# EAGLE design atmega_WS2812_RGB (EAGLE 6.3)
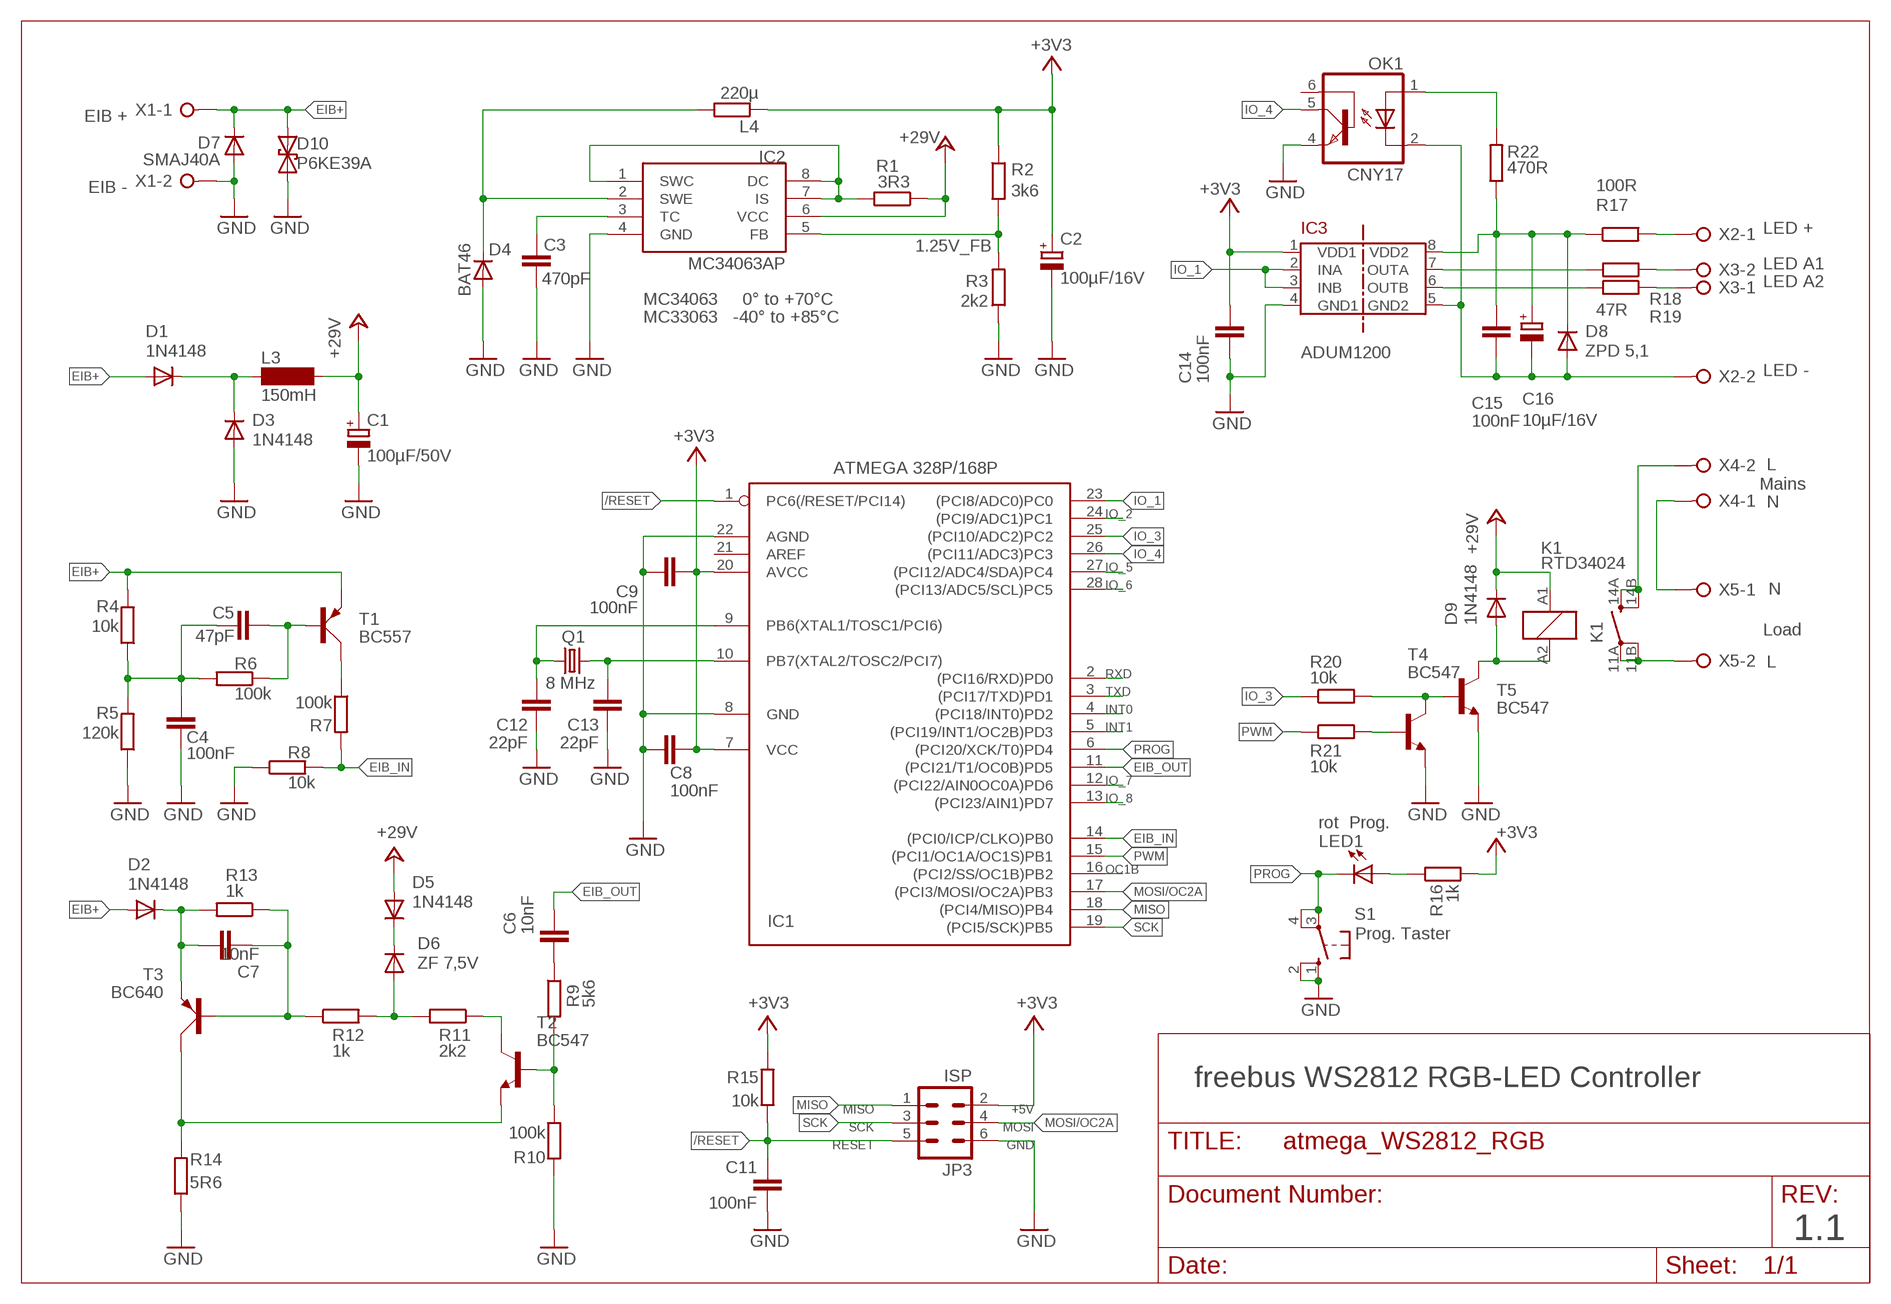
[diagram p0: schematic, sheet 1]

## Parts
C1  100µF/50V  CPOL-EUE3.5-8  [E3,5-8]
C2  100µF/16V  CPOL-EUE3.5-8  [E3,5-8]
C3  470pF  C-EU025-024X044  [C025-024X044]
C4  100nF  C-EU025-024X044  [C025-024X044]
C5  47pF  C-EU025-024X044  [C025-024X044]
C6  10nF  C-EU025-024X044  [C025-024X044]
C7  10nF  C-EU025-024X044  [C025-024X044]
C8  100nF  C-EU025-024X044  [C025-024X044]
C9  100nF  C-EU025-024X044  [C025-024X044]
C11  100nF  C-EU025-024X044  [C025-024X044]
C12  22pF  C-EU025-024X044  [C025-024X044]
C13  22pF  C-EU025-024X044  [C025-024X044]
C14  100nF  C-EU025-024X044  [C025-024X044]
C15  100nF  C-EU025-024X044  [C025-024X044]
C16  10µF/16V  CPOL-EUE2-5  [E2-5]
D1  1N4148  1N4148DO34-7R  [DO34-7R]
D2  1N4148  1N4148DO34-7R  [DO34-7R]
D3  1N4148  1N4148DO34-7R  [DO34-7R]
D4  BAT46  1N4148DO34-7R  [DO34-7R]
D5  1N4148  1N4148DO34-7R  [DO34-7R]
D6  ZF 7,5V  1N4148DO34-7R  [DO34-7R]
D7  SMAJ40A  D-SMB  [SMB]
D8  ZPD 5,1  1N4148DO34-7R  [DO34-7R]
D9  1N4148  1N4148DO34-7R  [DO34-7R]
D10  P6KE39A  P6KEXXCDO41-7  [DO41-7]
IC1  ATMEGA 328P/168P  ATMEGA168-20P  [DIL28-3]
IC2  MC34063AP  [DIL08]
IC3  ADUM1200  [SO8]
JP3  ISP  ISP_6POLML6  [ML6]
K1  RTD34024  [RT-N/O16A5]
L3  150mH  BS11  [BS11]
L4  220µ  R-EU_0309/12  [0309/12]
LED1  rot Prog.  LED3MM  [LED3MM]
OK1  CNY17  [DIL06]
Q1  8 MHz  CRYSTALHC49U-V  [HC49U-V]
R1  3R3  R-EU_0207/7  [0207/7]
R2  3k6  R-EU_0207/7  [0207/7]
R3  2k2  R-EU_0207/7  [0207/7]
R4  10k  R-EU_0207/7  [0207/7]
R5  120k  R-EU_0207/7  [0207/7]
R6  100k  R-EU_0207/7  [0207/7]
R7  100k  R-EU_0207/7  [0207/7]
R8  10k  R-EU_0207/7  [0207/7]
R9  5k6  R-EU_0207/7  [0207/7]
R10  100k  R-EU_0207/7  [0207/7]
R11  2k2  R-EU_0207/7  [0207/7]
R12  1k  R-EU_0207/7  [0207/7]
R13  1k  R-EU_0207/7  [0207/7]
R14  5R6  R-EU_0207/7  [0207/7]
R15  10k  R-EU_0207/7  [0207/7]
R16  1k  R-EU_0207/7  [0207/7]
R17  100R  R-EU_0207/7  [0207/7]
R18  47R  R-EU_0207/7  [0207/7]
R19  47R  R-EU_0207/7  [0207/7]
R20  10k  R-EU_0207/7  [0207/7]
R21  10k  R-EU_0207/7  [0207/7]
R22  470R  R-EU_0207/7  [0207/7]
S1  Prog. Taster  10-XX  [B3F-10XX]
T1  BC557  [SOT54A]
T2  BC547  [TO92]
T3  BC640  [SOT54D]
T4  BC547  [TO92]
T5  BC547  [TO92]
X1  W237-02P  [W237-132]
X2  W237-02P  [W237-132]
X3  W237-02P  [W237-132]
X4  W237-02P  [W237-132]
X5  W237-02P  [W237-132]

## Nets
1.25V_FB: IC2.5(FB) R2.2 R3.2
+3V3: C2.+ C8.1 C9.1 C14.2 IC1.7(VCC) IC1.20(AVCC) IC3.1(VDD1) JP3.2 L4.1 R2.1 R15.2 R16.2
+24V: C1.+ D5.A D9.C IC2.6(VCC) K1.A1 L3.2 R1.1 ; supply symbol labelled +29V
/RESET: C11.2 IC1.1(PC6(/RESET/PCI14)) JP3.5 R15.1
EIB+: D1.A D2.A D7.1(C) D10.C R4.2 T1.E X1.1
EIB_IN: IC1.14((PCI0/ICP/CLKO)PB0) R7.2 R8.2
EIB_OUT: C6.2 IC1.11((PCI21/T1/OC0B)PD5)
GND: C1.- C2.- C3.1 C4.1 C8.2 C9.2 C11.1 C12.2 C13.2 C14.1 D3.A D4.A D7.2(A) D10.A IC1.8(GND) IC1.22(AGND) IC2.4(GND) IC3.4(GND1) JP3.6 OK1.4(EMI) R3.1 R5.1 R8.1 R10.2 R14.1 S1.1(S) S1.2(S1) T4.1(E) T5.1(E) X1.2
INT0: IC1.4((PCI18/INT0)PD2)
INT1: IC1.5((PCI19/INT1/OC2B)PD3)
IO_1: IC1.23((PCI8/ADC0)PC0) IC3.2(INA) IC3.3(INB)
IO_2: IC1.24((PCI9/ADC1)PC1)
IO_3: IC1.25((PCI10/ADC2)PC2) R20.1
IO_4: IC1.26((PCI11/ADC3)PC3) OK1.5(COL)
IO_5: IC1.27((PCI12/ADC4/SDA)PC4)
IO_6: IC1.28((PCI13/ADC5/SCL)PC5)
IO_7: IC1.12((PCI22/AIN0OC0A)PD6)
IO_8: IC1.13((PCI23/AIN1)PD7)
MISO: IC1.18((PCI4/MISO)PB4) JP3.1
MOSI/OC2A: IC1.17((PCI3/MOSI/OC2A)PB3) JP3.4
N$1: R18.1 X3.2
N$2: C15.2 C16.+ D8.C IC3.8(VDD2) R17.1 R22.1
N$3: IC3.7(OUTA) R18.2
N$4: IC3.6(OUTB) R19.2
N$5: X4.1 X5.1
N$6: R17.2 X2.1
N$7: R21.2 T4.2(B)
N$8: R19.1 X3.1
N$9: LED1.A R16.1
N$11: R20.2 T4.3(C) T5.2(B)
N$12: K1.11A(2:PA) K1.11B(2:PB) X5.2
N$13: C4.2 C5.1 R4.1 R5.2 R6.2
N$14: R7.1 T1.C
N$15: K1.14A(2:SA) K1.14B(2:SB) X4.2
N$17: IC2.1(SWC) IC2.7(IS) IC2.8(DC) R1.2
N$18: D1.C D3.C L3.1
N$19: C6.1 R9.1
N$20: R9.2 R10.1 T2.2(B)
N$21: C7.2 R12.1 R13.1 T3.B
N$22: OK1.1(A) R22.2
N$23: D5.C D6.C
N$26: D4.C IC2.2(SWE) L4.2
N$27: C3.2 IC2.3(TC)
N$31: D6.A R11.2 R12.2
N$33: C5.2 R6.1 T1.B
N$34: R11.1 T2.3(C)
N$35: R14.2 T2.1(E) T3.C
N$36: C7.1 D2.C R13.2 T3.E
N$38: C13.1 IC1.10(PB7(XTAL2/TOSC2/PCI7)) Q1.2
N$39: C12.1 IC1.9(PB6(XTAL1/TOSC1/PCI6)) Q1.1
OC1B: IC1.16((PCI2/SS/OC1B)PB2)
PROG: IC1.6((PCI20/XCK/T0)PD4) LED1.K(C) S1.3(P) S1.4(P1)
PWM: IC1.15((PCI1/OC1A/OC1S)PB1) R21.1
R4: D9.A K1.A2 T5.3(C)
RXD: IC1.2((PCI16/RXD)PD0)
SCK: IC1.19((PCI5/SCK)PB5) JP3.3
TXD: IC1.3((PCI17/TXD)PD1)
WS2812_GND: C15.1 C16.- D8.A IC3.5(GND2) OK1.2(C) X2.2
Unconnected: IC1.21(AREF) OK1.6(BAS)

## Notes on the sheet
- EIB +
- EIB -
- LED +
- LED A1
- LED A2
- MC34063     0° to +70°C
- MC33063   -40° to +85°C
- ADUM1200
- LED -
- L
- Mains
- N
- N
- Load
- L
- freebus WS2812 RGB-LED Controller
- 1.1

## Library data of the parts
C1 C2 C16 = rcl:CPOL-EU: POLARIZED CAPACITOR, European symbol
C3-C9 C11-C15 = rcl:C-EU: CAPACITOR, European symbol
D1-D6 D8 D9 = diode:1N4148: DIODE high speed (Philips)
D7 = semicon-smd-ipc:D-: DIODE unfilled
D10 = diode:P6KEXXC: DIODE transient-voltage suppressor
IC1 = avr:ATMEGA168*P: MICROCONTROLLER 16 kBytes FLASH 1 kBytes SRAM 512 Bytes EEPROM USART 8-channel 10 bit ADC
IC2 = mc34063:MC34063
IC3 = Bus-isolators:ADUM1200
JP3 = avr:ISP_6POL
K1 = relay:RTD3*: Power PCB Relay SCHRACK 1 pole 12 / 16 A, DC- or AC-coil Source: http://www.schrack.com/.. 5819.pdf; MF: TYCO ELECTRONICS; MPN: RTD34024F; OC_FARNELL: 9850961; OC_NEWARK: 34K0187
L3 = Uwe:BS: INDUCTOR nominal inductance, magnetically screened; OC_FARNELL: unknown; OC_NEWARK: unknown
L4 R1-R22 = rcl:R-EU_: RESISTOR, European symbol
LED1 = Uwe:LED: LED OSRAM: - CHIPLED LG R971, LG N971, LY N971, LG Q971, LY Q971, LO R971, LY R971 LH N974, LH R974 LS Q976, LO Q976, LY Q976 LO Q996 - Hyper CHIPLED LW Q18S LB Q993, LB Q99A, LB R99A - SideLED LS A670, LO A670, LY A670, LG A670, LP A670 LB A673, LV A673, LT A673, LW A673 LH A674 LY A675 LS A676, LA A676, LO A676, LY A676, LW A676 LS A679, LY A679, LG A679 - Hyper Micro SIDELED® LS Y876, LA Y876, LO Y876, LY Y876 LT Y87S - SmartLED LW L88C, LW L88S LB L89C, LB L89S, LG L890 LS L89K, LO L89K, LY L89K LS L896, LA L896, LO L896, LY L896 - TOPLED LS T670, LO T670, LY T670, LG T670, LP T670 LSG T670, LSP T670, LSY T670, LOP T670, LYG T670 LG T671, LOG T671, LSG T671 LB T673, LV T673, LT T673, LW T673 LH T674 LS T676, LA T676, LO T676, LY T676, LB T676, LH T676, LSB T676, LW T676 LB T67C, LV T67C, LT T67C, LS T67K, LO T67K, LY T67K, LW E67C LS E67B, LA E67B, LO E67B, LY E67B, LB E67C, LV E67C, LT E67C LW T67C LS T679, LY T679, LG T679 LS T770, LO T770, LY T770, LG T770, LP T770 LB T773, LV T773, LT T773, LW T773 LH T774 LS E675, LA E675, LY E675, LS T675 LS T776, LA T776, LO T776, LY T776, LB T776 LHGB T686 LT T68C, LB T68C - Hyper Mini TOPLED® LB M676 - Mini TOPLED Santana® LG M470 LS M47K, LO M47K, LY M47K Source: http://www.osram.convergy.de LUXEON: - LUMILED® LXK2-PW12-R00, LXK2-PW12-S00, LXK2-PW14-U00, LXK2-PW14-V00 LXK2-PM12-R00, LXK2-PM12-S00, LXK2-PM14-U00 LXK2-PE12-Q00, LXK2-PE12-R00, LXK2-PE12-S00, LXK2-PE14-T00, LXK2-PE14-U00 LXK2-PB12-K00, LXK2-PB12-L00, LXK2-PB12-M00, LXK2-PB14-N00, LXK2-PB14-P00, LXK2-PB14-Q00 LXK2-PR12-L00, LXK2-PR12-M00, LXK2-PR14-Q00, LXK2-PR14-R00 LXK2-PD12-Q00, LXK2-PD12-R00, LXK2-PD12-S00 LXK2-PH12-R00, LXK2-PH12-S00 LXK2-PL12-P00, LXK2-PL12-Q00, LXK2-PL12-R00 Source: www.luxeon.com KINGBRIGHT: KA-3528ASYC Source: www.kingbright.com
OK1 = Uwe:CNY17: SIEMENS OPTO COUPLER; MPN: CNY17-1; OC_FARNELL: 1045399; OC_NEWARK: 05M4044
Q1 = crystal:CRYSTAL: CRYSTAL; OC_FARNELL: 1666969; OC_NEWARK: unknown
S1 = switch-omron:10-XX: OMRON SWITCH; MPN: B3F-1000; OC_FARNELL: 176432; OC_NEWARK: 36M3542
T1 = transistor-small-signal:BC557: PNP TRANSISTOR
T2 = transistor:BC547: NPN TRANSISTOR
T3 = transistor-small-signal:BC640: PNP TRANSISTOR
T4 T5 = transistor-npn:BC547*: NPN Transistor
X1-X5 = con-wago-508:W237-02P: WAGO SREW CLAMP; OC_FARNELL: unknown; OC_NEWARK: unknown

## Board
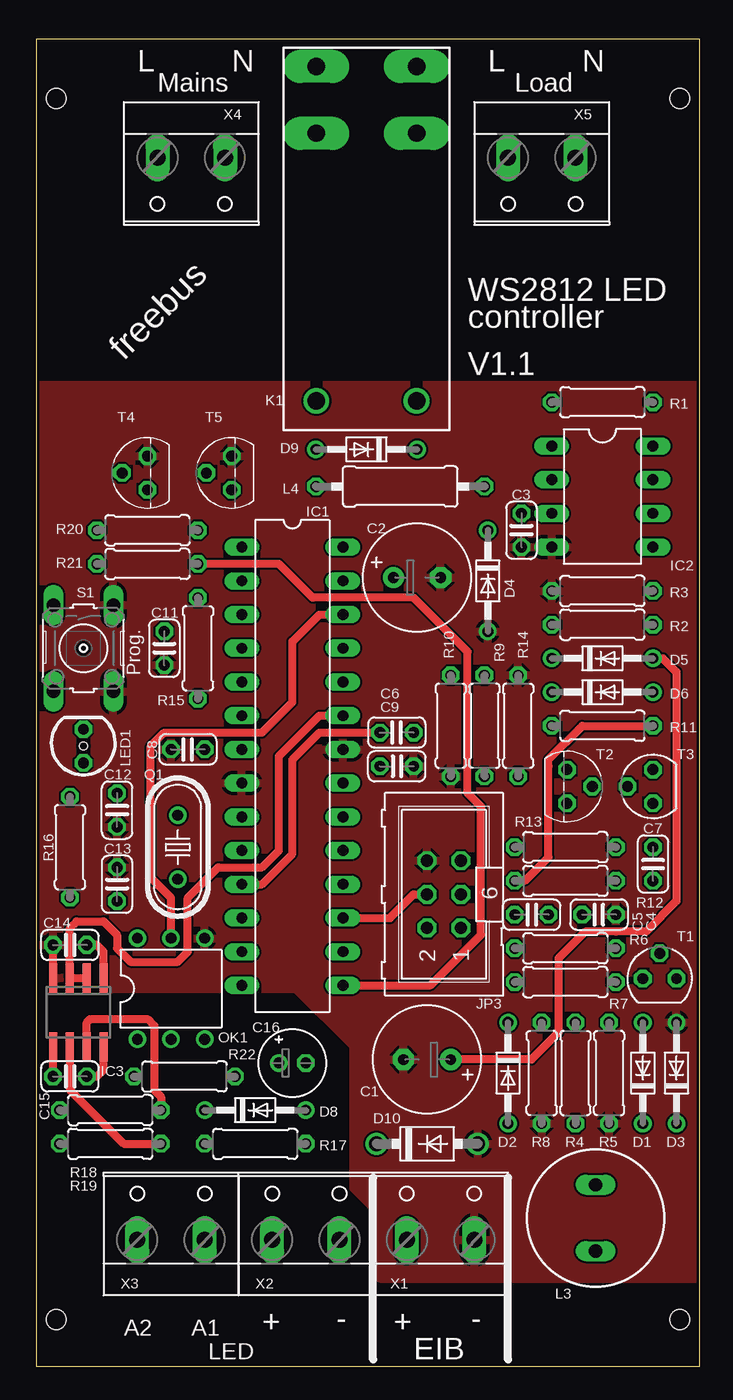
[diagram p1: board, top side]
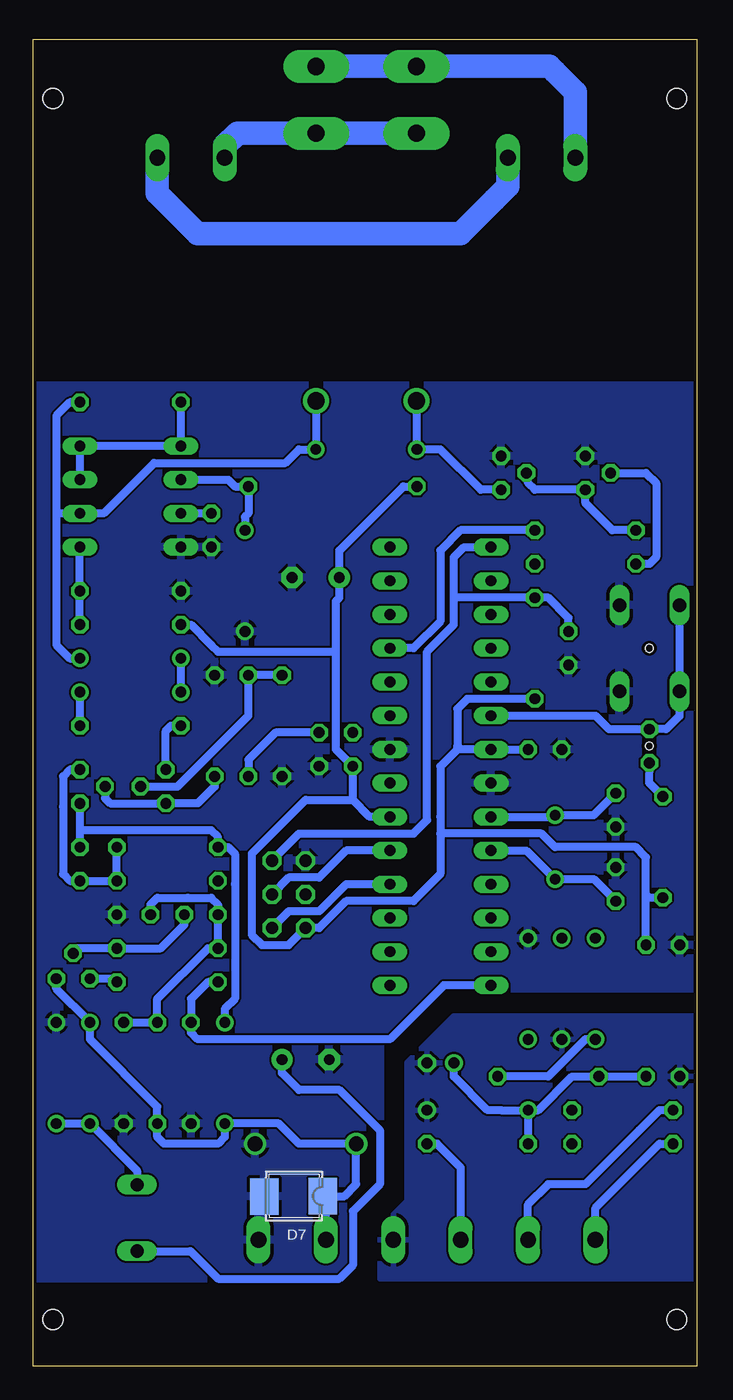
[diagram p2: board, bottom side, seen from below]

Size 50 x 100 mm. Coordinates in mm from the lower left corner, seen from the top.
Outline: 0,0 50,0 50,100 0,100 0,0
Copper layers (1*16): Top 0.035mm / dielectric 1.5mm / Bottom 0.035mm
Design rules "SeeedStudio_DRU_no_angle_2layer": minimum track width 6mil, minimum drill 12mil, track to track 6mil, track to pad 6mil, pad to pad 6mil, via to via 6mil, smd to smd 0mil, copper to edge 10mil, drill to drill 10mil, minimum pad ring 10mil, minimum via ring 6mil, stop-mask expansion 2mil, vias tented up to drill 25mil, thermal gap 10mil
Holes 1.5 mm at 1.5,3.52 48.5,3.52 1.5,95.52 48.5,95.52
Holes 0.6 mm at 3.56,46.74 3.56,54.1

### Footprints (pad centres in the part's own frame; a part is rotated, then mirrored left to right if it is on the bottom)
E3,5-8 = drill 0.813 pad 1.6: + -1.778,0 | drill 0.813 pad 1.6 octagon: - 1.778,0
C025-024X044 = drill 0.813 octagon: 1 -1.27,0; 2 1.27,0
E2-5 = drill 0.813 pad 1.27: + -1.016,0 | drill 0.813 pad 1.27 octagon: - 1.016,0
DO34-7R = drill 0.813: A 3.81,0; C -3.81,0
SMB = smd 2.159 x 2.743: 1 -2.311,-0.127; 2 2.108,-0.102
DO41-7 = drill 1.118: A 3.81,0; C -3.81,0
DIL28-3 = drill 0.813 long: 1 -16.51,-3.81; 2 -13.97,-3.81; 3 -11.43,-3.81; 4 -8.89,-3.81; 5 -6.35,-3.81; 6 -3.81,-3.81; 7 -1.27,-3.81; 8 1.27,-3.81; 9 3.81,-3.81; 10 6.35,-3.81; 11 8.89,-3.81; 12 11.43,-3.81; 13 13.97,-3.81; 14 16.51,-3.81; 15 16.51,3.81; 16 13.97,3.81; 17 11.43,3.81; 18 8.89,3.81; 19 6.35,3.81; 20 3.81,3.81; 21 1.27,3.81; 22 -1.27,3.81; 23 -3.81,3.81; 24 -6.35,3.81; 25 -8.89,3.81; 26 -11.43,3.81; 27 -13.97,3.81; 28 -16.51,3.81
DIL08 = drill 0.813 long: 1 -3.81,-3.81; 2 -1.27,-3.81; 3 1.27,-3.81; 4 3.81,-3.81; 5 3.81,3.81; 6 1.27,3.81; 7 -1.27,3.81; 8 -3.81,3.81
SO8 = smd 0.6 x 2.2: 1 -1.905,-2.6; 2 -0.635,-2.6; 3 0.635,-2.6; 4 1.905,-2.6; 5 1.905,2.6; 6 0.635,2.6; 7 -0.635,2.6; 8 -1.905,2.6
ML6 = drill 0.914 octagon: 1 -2.54,-1.27; 2 -2.54,1.27; 3 0,-1.27; 4 0,1.27; 5 2.54,-1.27; 6 2.54,1.27
RT-N/O16A5 = drill 1.3 pad 2.5 long: 11A 7.56,3.78; 11B 7.56,-3.78; 14A 12.6,3.78; 14B 12.6,-3.78 | drill 1.3: A1 -12.6,-3.78; A2 -12.6,3.78
BS11 = drill 1 long: 1 -2.5,0; 2 2.5,0
0309/12 = drill 0.813 octagon: 1 -6.35,0; 2 6.35,0
LED3MM = drill 0.813 octagon: A -1.27,0; K 1.27,0
DIL06 = drill 0.813: 1 -2.54,-3.81; 2 0,-3.81; 3 2.54,-3.81; 4 2.54,3.81; 5 0,3.81; 6 -2.54,3.81
HC49U-V = drill 0.813: 1 -2.413,0; 2 2.413,0
0207/7 = drill 0.813 octagon: 1 -3.81,0; 2 3.81,0
B3F-10XX = drill 1.016 long: 1 -3.251,2.261; 2 3.251,2.261; 3 -3.251,-2.261; 4 3.251,-2.261
SOT54A = drill 0.813 octagon: B 0,1.905; C -1.27,0; E 1.27,0
TO92 = drill 0.813 octagon: 1 1.27,0; 2 0,1.905; 3 -1.27,0
SOT54D = drill 0.813 octagon: B 1.27,0; C 0,1.905; E -1.27,0
W237-132 = drill 1.194 long: 1 -2.54,-0.635; 2 2.54,-0.635

### Placement (x,y rotation side)
C1  29.46,23.11 180 top
C2  28.7,59.44 0 top
C3  36.58,62.99 90 top
C4  42.42,34.04 180 top
C5  37.34,34.04 0 top
C6  27.18,47.75 180 top
C7  46.48,37.85 270 top
C8  11.43,46.48 180 top
C9  27.18,45.21 0 top
C11  9.65,54.1 90 top
C12  6.1,41.91 270 top
C13  6.1,36.32 90 top
C14  2.54,31.75 0 top
C15  2.54,21.84 0 top
C16  19.3,22.86 0 top
D1  45.72,22.1 90 top
D2  35.56,22.1 270 top
D3  48.26,22.1 90 top
D4  34.04,59.18 270 top
D5  42.67,53.34 0 top
D6  42.67,50.8 0 top
D7  30.48,12.7 180 bottom
D8  16.51,19.3 0 top
D9  24.89,69.09 180 top
D10  29.46,16.76 0 top
IC1  19.3,45.21 270 top
IC2  42.67,65.53 270 top
IC3  3.17,26.67 180 top
JP3  30.73,35.56 90 top
K1  24.89,85.34 90 top
L3  42.16,11.18 270 top
L4  27.43,66.29 0 top
LED1  3.56,46.74 90 top
OK1  10.16,28.45 0 top
Q1  10.67,39.12 270 top
R1  42.67,72.64 180 top
R2  42.67,55.88 0 top
R3  42.67,58.42 0 top
R4  40.64,22.1 270 top
R5  43.18,22.1 90 top
R6  39.88,31.5 180 top
R7  39.88,28.96 180 top
R8  38.1,22.1 90 top
R9  33.78,48.26 90 top
R10  31.24,48.26 270 top
R11  42.67,48.26 0 top
R12  39.88,36.58 180 top
R13  39.88,39.12 180 top
R14  36.32,48.26 270 top
R15  12.19,54.1 270 top
R16  2.54,39.12 270 top
R17  16.51,16.76 0 top
R18  5.59,19.3 0 top
R19  5.59,16.76 0 top
R20  8.38,62.99 180 top
R21  8.38,60.45 180 top
R22  11.18,21.84 0 top
S1  3.56,54.1 270 top
T1  46.99,29.21 0 top
T2  40.01,43.69 270 top
T3  46.48,43.69 90 top
T4  8.38,67.31 90 top
T5  14.73,67.31 90 top
X1  30.48,10.16 0 top
X2  20.32,10.16 0 top
X3  10.16,10.16 0 top
X4  11.68,90.42 180 top
X5  38.1,90.42 180 top

### Tracks (layer width: path | path; a pad name or v marks a point on that pad's centre or on a via)
1.25V_FB
  Bottom 0.61: R2.2 R3.2 IC2.5
+3V3
  Top 0.61: IC3.1 5.08,31.24 4.57,31.75 C14.2
  Bottom 0.61: C8.1 IC1.7 17.78,46.48 | 17.78,46.48 18.03,46.48 19.3,45.21 19.3,41.4 19.3,40.13 | R15.2 17.27,50.29 18.03,49.53 18.03,46.74 17.78,46.48 | C14.2 3.81,35.56 | 3.81,35.56 3.81,38.35 4.57,39.12 10.67,39.12 11.68,40.13 19.3,40.13 | R16.2 3.56,35.31 3.81,35.56 | IC1.20 24.64,41.4 25.91,42.67 | 25.91,42.67 C9.1 27.18,46.48 27.18,49.78 27.18,51.05 27.18,53.85 | 19.3,40.13 19.3,37.08 21.34,35.05 26.42,35.05 28.45,33.02 JP3.2 30.73,31.75 32.77,31.75 33.53,32.51 33.53,33.02 33.53,38.61 29.46,42.67 25.91,42.67 | R2.1 38.1,55.88 36.58,54.36 36.07,53.85 27.18,53.85 | 27.18,53.85 27.18,57.66 26.92,57.91 C2.+ 26.92,61.47 22.1,66.29 L4.1
+24V
  Top 0.61: D5.A 47.24,53.34 48.26,52.32 48.26,35.05 45.97,32.77 43.69,32.77 41.4,32.77 39.37,30.73 39.37,25.15 37.34,23.11 C1.+
  Bottom 0.61: L3.2 38.14,8.68 36.07,6.6 26.92,6.6 25.91,7.62 25.91,11.68 23.88,13.72 23.88,17.78 26.92,20.83 29.97,20.83 31.24,22.1 C1.+ | R1.1 47.24,72.64 48.26,71.63 48.26,64.26 | 48.26,64.26 IC2.6 44.7,64.26 40.89,68.07 30.99,68.07 29.97,69.09 D9.C 28.67,69.12 K1.A1 | 48.26,64.26 48.26,54.36 47.24,53.34 D5.A
/RESET
  Bottom 0.61: JP3.5 29.97,40.13 21.34,40.13 20.32,41.15 20.32,53.85 19.3,54.86 18.29,55.88 18.29,57.91 | 18.29,57.91 18.29,58.93 18.29,60.96 17.53,61.72 IC1.1 | 18.29,57.91 R15.1 11.18,57.91 9.65,56.39 C11.2
EIB+
  Bottom 0.61: X1.1 27.94,12.6 D7.1 26.54,12.83 25.65,13.72 D10.C 29.97,16.76 31.5,18.29 D2.A 35.56,17.27 36.07,16.76 40.13,16.76 40.64,17.27 R4.2 40.64,19.56 45.72,24.64 D1.A 48.26,28.45 T1.E
EIB_IN
  Bottom 0.61: R7.2 36.83,28.96 38.1,27.69 R8.2 38.1,25.15 37.59,24.64 23.11,24.64 19.05,28.7 IC1.14
EIB_OUT
  Top 0.61: IC1.11 17.02,36.32 19.3,38.61 19.3,45.72 21.34,47.75 C6.2
GND
  Top 0.61: IC3.4 C14.1
  pour Bottom: 25.91,6.6 49.78,6.6 49.78,73.91 0,73.91 0,28.45 19.3,28.45 21.59,26.42 23.88,24.13 23.88,13.46 25.91,11.43
  pour Top: 25.91,6.6 49.78,6.6 49.78,73.91 0,73.91 0,31.5 1.52,31.5 1.52,28.45 19.56,28.45 23.88,24.13 23.88,13.46 25.91,11.43
IO_1
  Top 0.61: IC3.2 IC3.3 2.54,33.02 3.05,33.53 5.08,33.53 6.1,32.51 6.1,31.5 7.11,30.48 10.67,30.48 11.43,31.24 11.43,35.31 13.72,37.59 17.02,37.59 18.29,38.86 18.29,45.97 21.34,49.02 IC1.23
IO_3
  Bottom 0.61: R20.1 17.78,62.99 19.3,61.47 19.3,56.13 21.34,54.1 IC1.25
IO_4
  Top 0.61: OK1.5 10.16,35.31 9.14,36.32 8.64,36.83 8.64,46.74 9.65,47.75 17.02,47.75 19.3,50.04 19.3,54.61 21.34,56.64 IC1.26
MISO
  Bottom 0.61: IC1.18 26.42,36.32 28.45,34.29 30.73,34.29 JP3.1
MOSI/OC2A
  Top 0.61: IC1.17 26.67,33.78 28.45,35.56 JP3.4
N$1
  Bottom 0.61: R18.1 2.79,19.3 4.32,17.78 8.38,13.72 11.18,13.72 12.7,12.19 X3.2
N$2
  Top 0.61: C15.2 4.57,21.84 5.08,22.35 IC3.8
  Bottom 0.61: D8.C 14.73,19.3 15.75,19.3 18.29,21.84 C16.+ | D8.C R17.1 | D8.C 11.94,19.3 9.4,21.84 R22.1 C15.2
N$3
  Top 0.61: IC3.7 3.81,25.91 4.06,26.16 8.38,26.16 8.89,25.65 8.89,20.83 9.4,20.32 R18.2
N$4
  Top 0.61: IC3.6 2.54,20.83 6.6,16.76 R19.2
N$5
  Bottom 1.778: X4.1 14.22,88.9 15.24,87.88 17.78,85.34 37.59,85.34 40.64,88.39 X5.1
N$6
  Bottom 0.61: R17.2 19.56,16.76 17.78,14.99 X2.1
N$7
  Bottom 0.61: T4.2 3.81,67.31 3.05,66.55 3.05,60.96 3.56,60.45 R21.2
N$8
  Bottom 0.61: X3.1 7.62,11.94 2.79,16.76 R19.1
N$9
  Bottom 0.61: LED1.A 3.59,43.97 R16.1
N$11
  Bottom 0.61: T5.2 12.7,67.18 12.7,66.55 12.19,66.04 T4.3 8.38,65.02 6.35,62.99 R20.2
N$12
  Bottom 1.778: K1.11A K1.11B 34.6,92.9 35.56,91.95 X5.2
N$13
  Bottom 0.61: R5.2 R4.1 40.64,27.69 36.83,31.5 R6.2 C5.1 36.07,34.8 36.58,35.31 38.35,35.31 40.64,35.31 41.15,34.8 C4.2
N$14
  Bottom 0.61: T1.C 43.94,29.21 R7.1
N$15
  Bottom 1.778: X4.2 9.14,96.01 10.67,97.54 11.08,97.94 K1.14A K1.14B
N$17
  Bottom 0.61: IC2.7 IC2.8 IC2.1 R1.2
N$18
  Bottom 0.61: D3.C D1.C 42.16,14.73 L3.1
N$19
  Bottom 0.61: C6.1 31.75,47.75 33.78,45.72 R9.1
N$20
  Bottom 0.61: R10.1 R9.2 33.78,49.02 39.12,43.69 T2.2
N$21
  Bottom 0.61: R13.1 R12.1 C7.2 47.24,36.58 47.75,37.08 47.75,42.16 47.75,44.45 47.24,44.96 T3.B
N$22
  Bottom 0.61: OK1.1 8.38,24.64 11.18,21.84 R22.2
N$23
  Bottom 0.61: D6.C D5.C
N$26
  Bottom 0.61: IC2.2 35.31,66.8 34.8,66.29 L4.2 33.78,64.26 34.04,64.01 D4.C
N$27
  Bottom 0.61: C3.2 IC2.3
N$31
  Top 0.61: R12.2 36.83,36.58 38.61,38.35 38.61,45.21 38.61,45.72 41.15,48.26 R11.2
  Bottom 0.61: D6.A R11.2
N$33
  Bottom 0.61: T1.B 46.61,31.5 R6.1 40.39,31.5 38.61,33.27 C5.2
N$34
  Bottom 0.61: T2.3 40.01,47.88 39.62,48.26 R11.1
N$35
  Bottom 0.61: R14.2 36.32,43.69 37.59,42.42 T2.1 44.2,42.42 44.58,42.8 T3.C
N$36
  Bottom 0.61: T3.E 46.48,40.39 | 46.48,40.39 C7.1 | 46.48,40.39 44.2,40.39 36.58,40.39 36.07,39.88 36.07,39.62 R13.2 35.31,39.12 34.8,38.61 34.8,36.32 34.8,27.69 35.56,26.92 D2.C
N$38
  Bottom 0.61: IC1.10 12.83,38.86 Q1.2 7.75,36.7 C13.1
N$39
  Bottom 0.61: IC1.9 10.79,41.4 Q1.1 7.75,41.53 C12.1
PROG
  Bottom 0.61: S1.3 S1.4 1.29,49 2.29,48.01 3.52,48.01 LED1.K 3.65,48.01 6.6,48.01 7.62,49.02 IC1.6
PWM
  Top 0.61: IC1.15 29.72,28.7 33.53,32.51 33.53,42.16 32.51,43.18 32.51,53.85 28.45,57.91 20.83,57.91 18.29,60.45 R21.1
R4
  Bottom 0.61: T5.3 16.26,66.04 19.3,69.09 D9.A 21.08,72.71 K1.A2
SCK
  Bottom 0.61: IC1.19 26.42,38.86 28.45,36.83 30.73,36.83 JP3.3
WS2812_GND
  Top 0.61: C15.1 IC3.5
  pour Bottom: 0,6.6 23.88,6.6 23.88,10.41 21.84,12.45 21.84,22.86 18.29,26.42 0,26.42

### Text on the board
tPlace: L | N | L | N | Mains | Load | WS2812 LED | controller | freebus | V1.1 | Prog. | + | - | + | - | A2 | A1 | LED | EIB